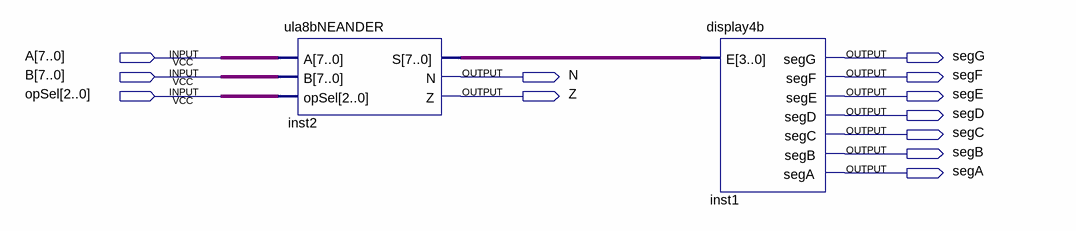
[diagram p0: schematic sheet]
// Quartus schematic ula4bDisplay.bdf as structural Verilog: 2 symbols, 12 pins
module ula4bDisplay (
  input  [7:0] A,
  input  [7:0] B,
  input  [2:0] opSel,
  output segG,
  output N,
  output segF,
  output Z,
  output segE,
  output segD,
  output segC,
  output segB,
  output segA
);

  wire [7:0] inst2_s;

  ula8bNEANDER inst2 (.A(A), .B(B), .opSel(opSel), .S(inst2_s), .N(N), .Z(Z));
  display4b inst1 (
    .E(inst2_s), .segG(segG), .segF(segF), .segE(segE), .segD(segD), .segC(segC), .segB(segB), .segA(segA));
endmodule
